# Altium schematic sheet 红黑红黑的小黄鸡二队区赛2.0Mainboard.SchDoc
size A3
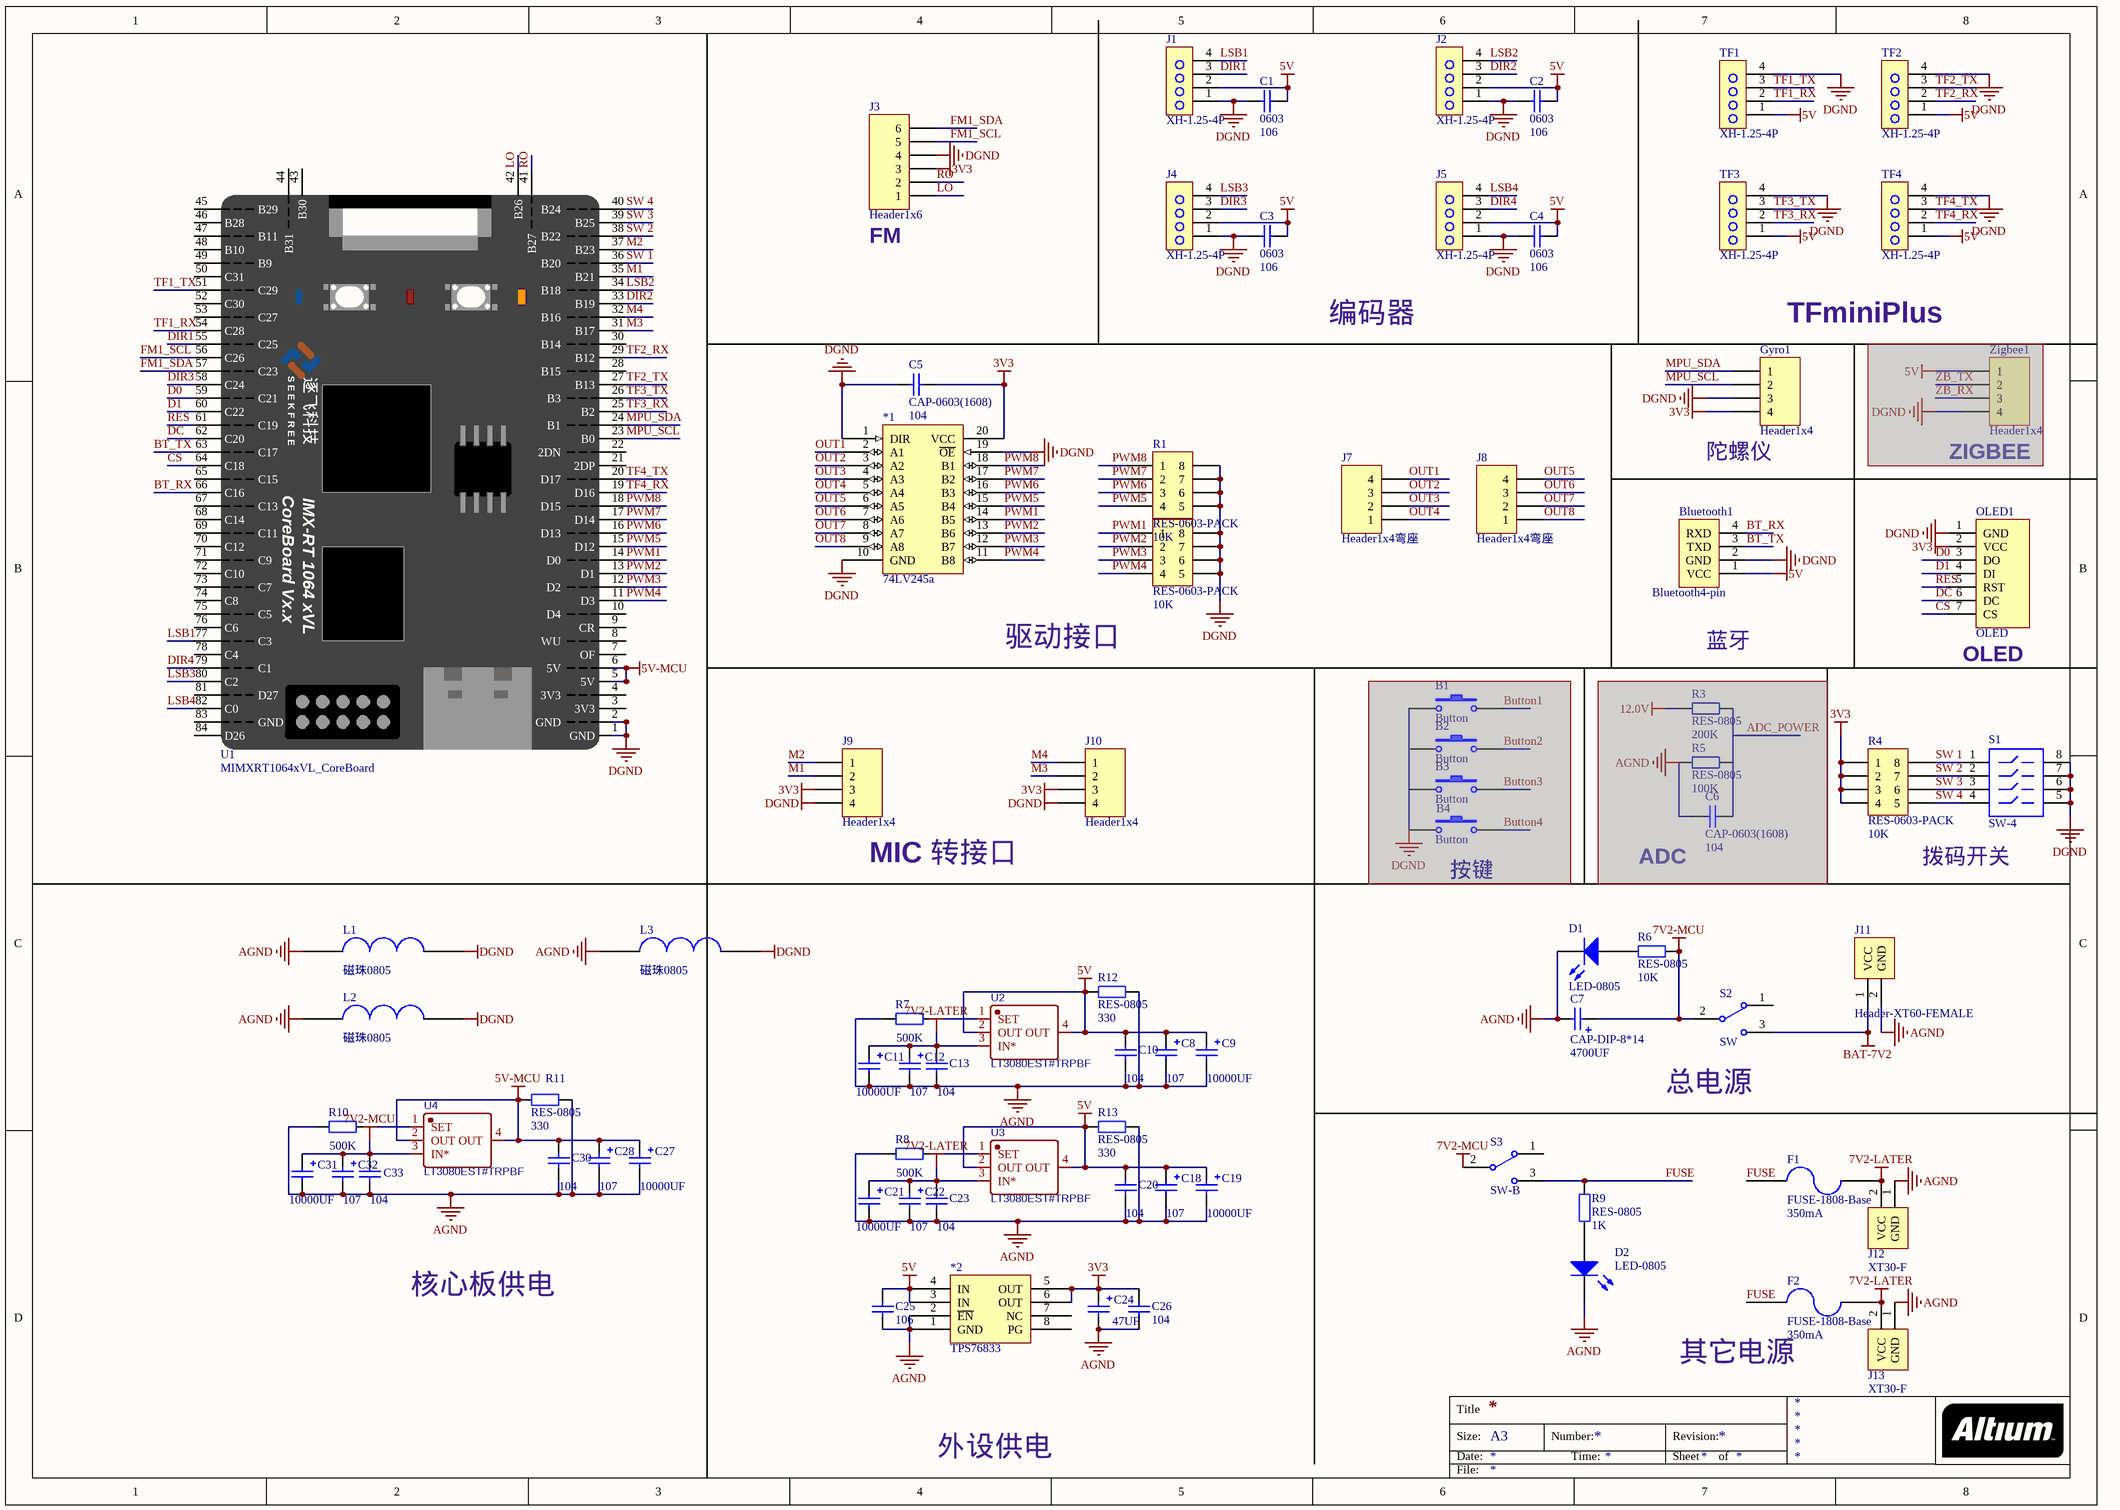
[diagram p0: 红黑红黑的小黄鸡二队区赛2.0Mainboard.SchDoc]

## Parts
*1  74LV245a  [TSSOP-20]
*2  TPS76833  [SOIC_8]
B1  Button  [Button-SMT]  (masked out: inside a compile mask, not in the netlist)
B2  Button  [Button-SMT]  (masked out: inside a compile mask, not in the netlist)
B3  Button  [Button-SMT]  (masked out: inside a compile mask, not in the netlist)
B4  Button  [Button-SMT]  (masked out: inside a compile mask, not in the netlist)
Bluetooth1  Bluetooth4-pin  [Bluetooth-4]
C1  0603  [CAP-0603]
C2  0603  [CAP-0603]
C3  0603  [CAP-0603]
C4  0603  [CAP-0603]
C5  CAP-0603(1608)  [CAP-0603]
C6  CAP-0603(1608)  [CAP-0603]  (masked out: inside a compile mask, not in the netlist)
C7  CAP-DIP-8*14  [CAP-DIP-8X14]
C8  (no value)  [CAP-3528]
C9  (no value)  [CAP-DIP-8X14]
C10  (no value)  [CAP-0603]
C11  (no value)  [CAP-DIP-8X14]
C12  (no value)  [CAP-3528]
C13  (no value)  [CAP-0603]
C18  (no value)  [CAP-3528]
C19  (no value)  [CAP-DIP-8X14]
C20  (no value)  [CAP-0603]
C21  (no value)  [CAP-DIP-8X14]
C22  (no value)  [CAP-3528]
C23  (no value)  [CAP-0603]
C24  CAP-TAN-3528(B)  [CAP-3528]  (value not drawn)
C25  CAP-0603(1608)  [CAP-0603]  (value not drawn)
C26  CAP-0603(1608)  [CAP-0603]  (value not drawn)
C27  (no value)  [CAP-DIP-8X14]
C28  (no value)  [CAP-3528]
C30  (no value)  [CAP-0603]
C31  (no value)  [CAP-DIP-8X14]
C32  (no value)  [CAP-3528]
C33  (no value)  [CAP-0603]
D1  LED-0805  [LED-0805]
D2  LED-0805  [LED-0805]
F1  FUSE-1808-Base  [Fuse1808_Base]
F2  FUSE-1808-Base  [Fuse1808_Base]
Gyro1  Header1x4  [HEADER1X4]
J1  XH-1.25-4P  [XH-1.25-4]
J2  XH-1.25-4P  [XH-1.25-4]
J3  Header1x6  [HEADER1X6]
J4  XH-1.25-4P  [XH-1.25-4]
J5  XH-1.25-4P  [XH-1.25-4]
J7  Header1x4弯座  [HEADER1X4 - BENT]
J8  Header1x4弯座  [HEADER1X4 - BENT]
J9  Header1x4  [HEADER1X4]
J10  Header1x4  [HEADER1X4]
J11  Header-XT60-FEMALE  [HEADER-XT60-FEMALE]
J12  XT30-F  [XT30PW-F]
J13  XT30-F  [XT30PW-F]
L1  磁珠0805  [bead-0805]
L2  磁珠0805  [bead-0805]
L3  磁珠0805  [bead-0805]
OLED1  OLED  [OLED]
R1  RES-0603-PACK  [RES-0603 - PACK]
R2  RES-0603-PACK  [RES-0603 - PACK]
R3  RES-0805  [RES-0805]  (masked out: inside a compile mask, not in the netlist)
R4  RES-0603-PACK  [RES-0603 - PACK]
R5  RES-0805  [RES-0805]  (masked out: inside a compile mask, not in the netlist)
R6  RES-0805  [RES-0805]
R7  (no value)  [RES-0805]
R8  (no value)  [RES-0805]
R9  RES-0805  [RES-0805]
R10  (no value)  [RES-0805]
R11  RES-0805  [RES-0805]
R12  RES-0805  [RES-0805]
R13  RES-0805  [RES-0805]
S1  SW-4  [DIP-8]
S2  SW  [SW-B]
S3  SW-B  [SW-B]
TF1  XH-1.25-4P  [XH-1.25-4]
TF2  XH-1.25-4P  [XH-1.25-4]
TF3  XH-1.25-4P  [XH-1.25-4]
TF4  XH-1.25-4P  [XH-1.25-4]
U1  MIMXRT1064xVL_CoreBoard  [MIMXRT1064xVL_CoreBoard]
U2  LT3080EST#TRPBF  [SOT-223-3_L6.5-W3.4-P2.30-LS7.0-BR]
U3  LT3080EST#TRPBF  [SOT-223-3_L6.5-W3.4-P2.30-LS7.0-BR]
U4  LT3080EST#TRPBF  [SOT-223-3_L6.5-W3.4-P2.30-LS7.0-BR]
Zigbee1  Header1x4  [HEADER1X4]  (masked out: inside a compile mask, not in the netlist)

## Nets
3V3: *1.20(VCC) *2.5(OUT) *2.6(OUT) C5.2 C24.1 C26.1 Gyro1.4 J3.3 J9.3 J10.3 OLED1.2(VCC) R4.1 R4.2 R4.3 R4.4
5V: *2.3(IN) *2.4(IN) Bluetooth1.1(VCC) C1.1 C2.1 C3.1 C4.1 C8.1 C9.1 C10.2 C18.1 C19.1 C20.2 C25.2 J1.2 J2.2 J4.2 J5.2 R12.1 R13.1 TF1.1 TF2.1 TF3.1 TF4.1 U2.2(OUT) U2.4(OUT) U3.2(OUT) U3.4(OUT)
5V-MCU: C27.1 C28.1 C30.2 R11.2 U1.5(5V) U1.6(5V) U4.2(OUT) U4.4(OUT)
7V2-LATER: C11.1 C12.1 C13.2 C21.1 C22.1 C23.2 F1.2 F2.2 J12.2(VCC) J13.2(VCC) U2.3(IN*) U3.3(IN*)
7V2-MCU: C7.1 C31.1 C32.1 C33.2 R6.2 S2.2 S3.2 U4.3(IN*)
AGND: *2.1(GND) *2.2(~{EN}) C7.2 C8.2 C9.2 C10.1 C11.2 C12.2 C13.1 C18.2 C19.2 C20.1 C21.2 C22.2 C23.1 C24.2 C25.1 C26.2 C27.2 C28.2 C30.1 C31.2 C32.2 C33.1 D1.2(K) D2.2(K) J11.2(GND) J12.1(GND) J13.1(GND) L1.1 L2.1 L3.1 R7.1 R8.1 R10.1 R11.1 R12.2 R13.2
BAT-7V2: J11.1(VCC) S2.3
DGND: *1.1(DIR) *1.10(GND) *1.19(~{OE}) Bluetooth1.2(GND) C1.2 C2.2 C3.2 C4.2 C5.1 Gyro1.3 J1.1 J2.1 J3.4 J4.1 J5.1 J9.4 J10.4 L1.2 L2.2 L3.2 OLED1.1(GND) R1.5 R1.6 R1.7 R1.8 R2.5 R2.6 R2.7 R2.8 S1.5 S1.6 S1.7 S1.8 TF1.4 TF2.4 TF3.4 TF4.4 U1.1(GND) U1.2(GND)
BT_RX: Bluetooth1.4(RXD) U1.66(C16)
BT_TX: Bluetooth1.3(TXD) U1.63(C17)
CS: OLED1.7(CS) U1.64(C18)
D0: OLED1.3(DO) U1.59(C21)
D1: OLED1.4(DI) U1.60(C22)
DC: OLED1.6(DC) U1.62(C20)
DIR1: J1.3 U1.55(C25)
DIR2: J2.3 U1.33(B19)
DIR3: J4.3 U1.58(C24)
DIR4: J5.3 U1.79(C1)
FM1_SCL: J3.5 U1.56(C26)
FM1_SDA: J3.6 U1.57(C23)
FUSE: F1.1 F2.1 R9.2 S3.3
LO: J3.1 U1.42(B26)
LSB1: J1.4 U1.77(C3)
LSB2: J2.4 U1.34(B18)
LSB3: J4.4 U1.80(C2)
LSB4: J5.4 U1.82(C0)
M1: J9.2 U1.35(B21)
M2: J9.1 U1.37(B23)
M3: J10.2 U1.31(B17)
M4: J10.1 U1.32(B16)
MPU_SCL: Gyro1.2 U1.23(B0)
MPU_SDA: Gyro1.1 U1.24(B1)
OUT1: *1.2(A1) J7.4
OUT2: *1.3(A2) J7.3
OUT3: *1.4(A3) J7.2
OUT4: *1.5(A4) J7.1
OUT5: *1.6(A5) J8.4
OUT6: *1.7(A6) J8.3
OUT7: *1.8(A7) J8.2
OUT8: *1.9(A8) J8.1
PWM1: *1.14(B5) R2.1 U1.14(D0)
PWM2: *1.13(B6) R2.2 U1.13(D1)
PWM3: *1.12(B7) R2.3 U1.12(D2)
PWM4: *1.11(B8) R2.4 U1.11(D3)
PWM5: *1.15(B4) R1.4 U1.15(D12)
PWM6: *1.16(B3) R1.3 U1.16(D13)
PWM7: *1.17(B2) R1.2 U1.17(D14)
PWM8: *1.18(B1) R1.1 U1.18(D15)
RES: OLED1.5(RST) U1.61(C19)
RO: J3.2 U1.41(B27)
SW 1: R4.8 S1.1 U1.36(B20)
SW 2: R4.7 S1.2 U1.38(B22)
SW 3: R4.6 S1.3 U1.39(B25)
SW 4: R4.5 S1.4 U1.40(B24)
TF1_RX: TF1.2 U1.54(C28)
TF1_TX: TF1.3 U1.51(C29)
TF2_RX: TF2.2 U1.29(B12)
TF2_TX: TF2.3 U1.27(B13)
TF3_RX: TF3.2 U1.25(B2)
TF3_TX: TF3.3 U1.26(B3)
TF4_RX: TF4.2 U1.19(D16)
TF4_TX: TF4.3 U1.20(D17)
NetD1_1: D1.1(A) R6.1
NetD2_1: D2.1(A) R9.1
NetR7_2: R7.2 U2.1(SET)
NetR8_2: R8.2 U3.1(SET)
NetR10_2: R10.2 U4.1(SET)

Not connected (* = marked no-connect by the designer): *2 7(NC) 8(PG); S2 1; S3 1; U1 3(3V3) 4(3V3) 7(OF) 8(WU) 9(CR) 10(D4) 21(2DP) 22(2DN) 28(B15) 30(B14) 43(B30) 44(B31) 45(B29) 46(B28) 47(B11) 48(B10) 49(B9) 50(C31) 52(C30) 53(C27) 65(C15) 67(C13) 68(C14) 69(C11) 70(C12) 71(C9) 72(C10) 73(C7) 74(C8) 75(C5) 76(C6) 78(C4) 81(D27) 83(GND) 84(D26)

## Notes on the sheet
- (near J3) FM
- 编码器
- TFminiPlus
- (near Gyro1) 陀螺仪
- (near Zigbee1) ZIGBEE
- 驱动接口
- 蓝牙
- (near OLED1) OLED
- (near J9) MIC 转接口
- (near B4) 按键
- (near C6) ADC
- 拨码开关
- (near S2) 总电源
- 核心板供电
- 其它电源
- 外设供电
- Title
- Size:
- Date:
- A3
- Number:
- Time:
- Revision:
- Sheet
- of
- File:
- (in symbol CAP-0603(1608)) 104; 106
- (in symbol CAP-DIP-8*14) 10000UF; 4700UF
- (in symbol CAP-TAN-3528(B)) 107; 47UF
- (in symbol FUSE-1808-Base) 350mA
- (in symbol MIMXRT1064xVL_CoreBoard) S E E K F R E E; 逐飞科技; CoreBoard Vx.x; IMX-RT 1064 xVL
- (in symbol RES-0603-PACK) 10K
- (in symbol RES-0805) 500K; 200K; 100K; 10K; 1K; 330

## Library data of the parts
*2 = TPS768xx
C1-C4 C10 C13 C20 C23 C30 C33 = CAP-0603(1608)
C7 C9 C11 C19 C21 C27 C31 = CAP-DIP-8*14: 100UF
C8 C12 C18 C22 C24 C28 C32 = CAP-TAN-3528(B): 0.15~150UF
F1 F2 = FUSE-1808-Base: 保险丝
J7 J8 = Header1x4
J11 = Header-XT60-FEMALE: 航模接头
J12 J13 = XT30-F: Ir=15A, Imax=30A, Vr=500V, Rc=0.8mΩ, -20°C-120°C, 1000Times
L1-L3 = 磁珠
R7 R8 R10 = RES-0805
U1 = MIMXRT1064xVL_CoreBoard: 逐飞科技i.MX RT1064核心板整体原理，可直接使用
U2-U4 = LT3080EST#TRPBF: BOM_Manufacturer: Linear Tech; Contributor: LCSC; BOM_Supplier: LCSC; BOM_Supplier Part: C107704; BOM_Manufacturer Part: LT3080EST#TRPBF; spicePre: U; spiceSymbolName: LT3080EST#TRPBF